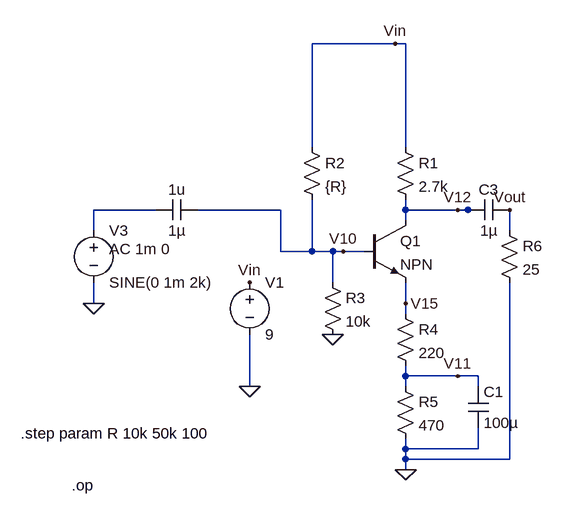
[diagram p0: schematic Draft4.asc]
Draft4.asc, the LTspice schematic file:
Version 4
SHEET 1 880 680
WIRE -144 -416 -272 -416
WIRE -128 -416 -144 -416
WIRE -272 -256 -272 -416
WIRE -128 -256 -128 -416
WIRE -512 -160 -608 -160
WIRE -320 -160 -448 -160
WIRE -128 -160 -128 -176
WIRE -48 -160 -128 -160
WIRE -32 -160 -48 -160
WIRE -16 -160 -32 -160
WIRE -128 -144 -128 -160
WIRE -608 -128 -608 -160
WIRE 32 -128 32 -160
WIRE -320 -96 -320 -160
WIRE -272 -96 -272 -176
WIRE -272 -96 -320 -96
WIRE -240 -96 -272 -96
WIRE -224 -96 -240 -96
WIRE -192 -96 -224 -96
WIRE -240 -48 -240 -96
WIRE -608 -16 -608 -48
WIRE -128 -16 -128 -48
WIRE -128 0 -128 -16
WIRE -128 96 -128 80
WIRE -48 96 -128 96
WIRE -16 96 -48 96
WIRE -368 112 -368 32
WIRE -128 112 -128 96
WIRE -16 112 -16 96
WIRE -128 208 -128 192
WIRE -16 208 -16 176
WIRE -16 208 -128 208
WIRE -128 224 -128 208
WIRE 32 224 32 -48
WIRE 32 224 -128 224
WIRE -128 240 -128 224
FLAG -368 112 0
FLAG -368 -48 Vin
FLAG -608 -16 0
FLAG -240 32 0
FLAG -128 240 0
FLAG -144 -416 Vin
FLAG 32 -160 Vout
FLAG -224 -96 V10
FLAG -48 96 V11
FLAG -48 -160 V12
FLAG -128 -16 V15
SYMBOL voltage -368 -64 R0
WINDOW 123 0 0 Left 0
WINDOW 39 0 0 Left 0
SYMATTR InstName V1
SYMATTR Value 9
SYMBOL npn -192 -144 R0
SYMATTR InstName Q1
SYMBOL res -144 -272 R0
SYMATTR InstName R1
SYMATTR Value 2.7k
SYMBOL res -288 -272 R0
SYMATTR InstName R2
SYMATTR Value {R}
SYMBOL res -256 -64 R0
SYMATTR InstName R3
SYMATTR Value 10k
SYMBOL cap -448 -176 R90
WINDOW 0 0 32 VBottom 2
WINDOW 3 32 32 VTop 2
SYMATTR InstName 1u
SYMATTR Value 1µ
SYMBOL voltage -608 -144 R0
WINDOW 123 24 44 Left 2
WINDOW 39 0 0 Left 0
SYMATTR InstName V3
SYMATTR Value SINE(0 1m 2k)
SYMATTR Value2 AC 1m 0
SYMBOL res -144 -16 R0
SYMATTR InstName R4
SYMATTR Value 220
SYMBOL res -144 96 R0
SYMATTR InstName R5
SYMATTR Value 470
SYMBOL cap -32 112 R0
SYMATTR InstName C1
SYMATTR Value 100µ
SYMBOL cap 32 -176 R90
WINDOW 0 0 32 VBottom 2
WINDOW 3 32 32 VTop 2
SYMATTR InstName C3
SYMATTR Value 1µ
SYMBOL res 16 -144 R0
SYMATTR InstName R6
SYMATTR Value 25
TEXT -642 264 Left 2 !.op
TEXT -720 184 Left 2 !.step param R 10k 50k 100

The netlist it stands for:
* Draft4.asc
V1 Vin 0 9
Q1 V12 V10 V15 0 NPN
R1 Vin V12 2.7k
R2 Vin V10 {R}
R3 V10 0 10k
C§1u V10 N001 1µ
V3 N001 0 SINE(0 1m 2k) AC 1m 0
R4 V15 V11 220
R5 V11 0 470
C1 V11 0 100µ
C3 Vout V12 1µ
R6 Vout 0 25
.model NPN NPN
.model PNP PNP
.lib standard.bjt
.op
.step param R 10k 50k 100
.backanno
.end